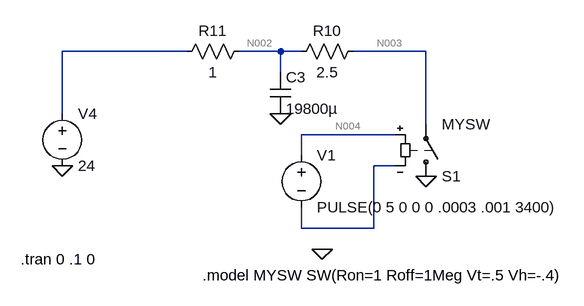
[diagram p0: schematic LED_checks.asc]
LED_checks.asc, the LTspice schematic file:
Version 4
SHEET 1 880 680
WIRE -864 240 -1056 240
WIRE -720 240 -784 240
WIRE -688 240 -720 240
WIRE -496 240 -608 240
WIRE -720 272 -720 240
WIRE -1056 336 -1056 240
WIRE -496 352 -496 240
WIRE -544 368 -688 368
WIRE -688 400 -688 368
WIRE -544 416 -576 416
WIRE -688 512 -688 480
WIRE -576 512 -576 416
WIRE -576 512 -688 512
FLAG -720 336 0
FLAG -1056 416 0
FLAG -496 432 0
FLAG -656 544 0
SYMBOL voltage -1056 320 R0
WINDOW 123 0 0 Left 0
WINDOW 39 0 0 Left 0
SYMATTR InstName V4
SYMATTR Value 24
SYMBOL cap -736 272 R0
SYMATTR InstName C3
SYMATTR Value 19800µ
SYMBOL res -592 224 R90
WINDOW 0 0 56 VBottom 2
WINDOW 3 32 56 VTop 2
SYMATTR InstName R10
SYMATTR Value 2.5
SYMBOL res -768 224 R90
WINDOW 0 0 56 VBottom 2
WINDOW 3 32 56 VTop 2
SYMATTR InstName R11
SYMATTR Value 1
SYMBOL sw -496 448 M180
SYMATTR InstName S1
SYMATTR Value MYSW
SYMBOL voltage -688 384 R0
WINDOW 123 0 0 Left 0
WINDOW 39 0 0 Left 0
SYMATTR InstName V1
SYMATTR Value PULSE(0 5 0 0 0 .0003 .001 3400)
TEXT -1120 560 Left 2 !.tran 0 .1 0
TEXT -840 584 Left 2 !.model MYSW SW(Ron=1 Roff=1Meg Vt=.5 Vh=-.4)

The netlist it stands for:
* LED_checks.asc
V4 N001 0 24
C3 N002 0 19800µ
R10 N003 N002 2.5
R11 N002 N001 1
S1 0 N003 N004 N005 MYSW
V1 N004 N005 PULSE(0 5 0 0 0 .0003 .001 3400)
.tran 0 .1 0
.model MYSW SW(Ron=1 Roff=1Meg Vt=.5 Vh=-.4)
.backanno
.end

* Results of the author's LTspice run, read from the files saved beside the schematic
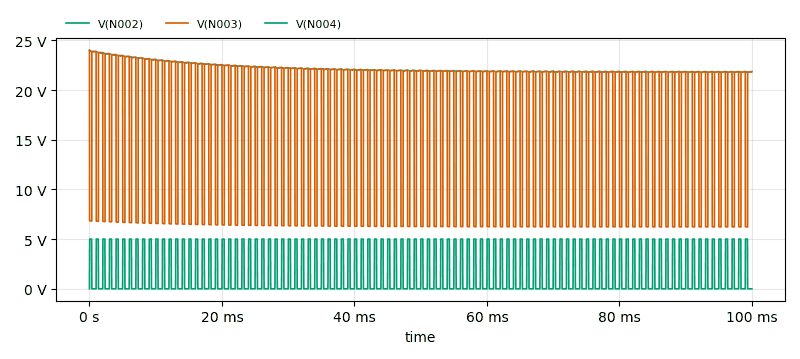
[diagram p1: Transient Analysis of LED_checks.asc, plotted from the saved traces]
* Transient Analysis, 1 run:
*   V(N002): min 21.79 V, max 24 V, average 22.2 V, rms 22.21 V, last 21.86 V
*   V(N003): min 6.226 V, max 24 V, average 16.68 V, rms 18.3 V, last 21.86 V
*   V(N004): min 0 V, max 5 V, average 1.65 V, rms 2.838 V, last 0 V